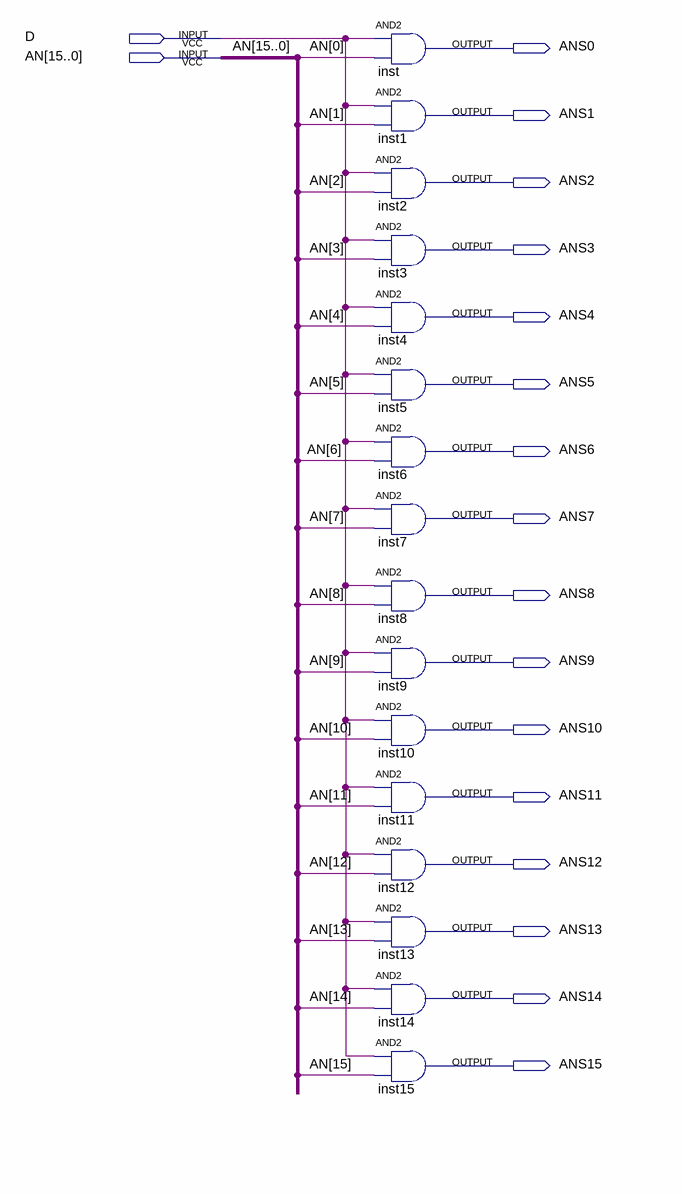
[diagram p0: schematic sheet]
// Quartus schematic AND16_1.bdf as structural Verilog: 16 symbols, 18 pins
module AND16_1 (
  input  D,
  input  [15:0] AN,
  output ANS0,
  output ANS1,
  output ANS2,
  output ANS3,
  output ANS4,
  output ANS5,
  output ANS6,
  output ANS7,
  output ANS8,
  output ANS9,
  output ANS10,
  output ANS11,
  output ANS12,
  output ANS13,
  output ANS14,
  output ANS15
);

  and inst (ANS0, D, AN[0]);
  and inst1 (ANS1, D, AN[1]);
  and inst2 (ANS2, D, AN[2]);
  and inst3 (ANS3, D, AN[3]);
  and inst4 (ANS4, D, AN[4]);
  and inst5 (ANS5, D, AN[5]);
  and inst6 (ANS6, D, AN[6]);
  and inst7 (ANS7, D, AN[7]);
  and inst8 (ANS8, D, AN[8]);
  and inst9 (ANS9, D, AN[9]);
  and inst10 (ANS10, D, AN[10]);
  and inst11 (ANS11, D, AN[11]);
  and inst12 (ANS12, D, AN[12]);
  and inst13 (ANS13, D, AN[13]);
  and inst14 (ANS14, D, AN[14]);
  and inst15 (ANS15, D, AN[15]);
endmodule
